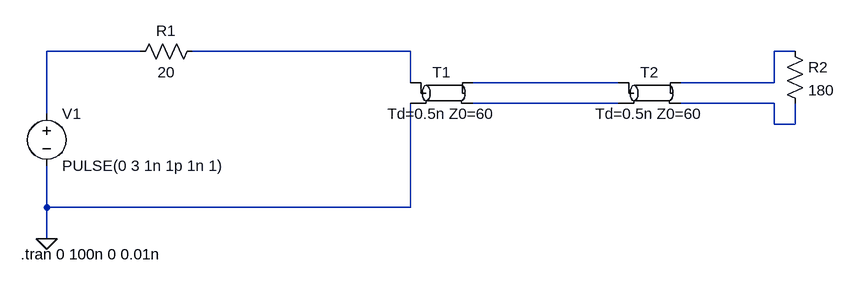
[diagram p0: schematic Q6.asc]
Q6.asc, the LTspice schematic file:
Version 4.1
SHEET 1 1412 680
WIRE 336 -16 192 -16
WIRE 752 -16 416 -16
WIRE 1344 -16 1312 -16
WIRE 752 32 752 -16
WIRE 1072 32 848 32
WIRE 1312 32 1312 -16
WIRE 1312 32 1168 32
WIRE 1072 64 848 64
WIRE 1312 64 1168 64
WIRE 192 80 192 -16
WIRE 1312 96 1312 64
WIRE 1344 96 1344 64
WIRE 1344 96 1312 96
WIRE 192 224 192 160
WIRE 752 224 752 64
WIRE 752 224 192 224
WIRE 192 272 192 224
FLAG 192 272 0
SYMBOL voltage 192 64 R0
WINDOW 123 0 0 Left 0
WINDOW 39 0 0 Left 0
SYMATTR InstName V1
SYMATTR Value PULSE(0 3 1n 1p 1n 1)
SYMBOL res 432 -32 R90
WINDOW 0 0 56 VBottom 2
WINDOW 3 32 56 VTop 2
SYMATTR InstName R1
SYMATTR Value 20
SYMBOL tline 800 48 R0
SYMATTR InstName T1
SYMATTR Value Td=0.5n Z0=60
SYMBOL res 1328 -32 R0
SYMATTR InstName R2
SYMATTR Value 180
SYMBOL tline 1120 48 R0
SYMATTR InstName T2
SYMATTR Value Td=0.5n Z0=60
TEXT 152 296 Left 2 !.tran 0 100n 0 0.01n

The netlist it stands for:
* Q6.asc
V1 N001 0 PULSE(0 3 1n 1p 1n 1)
R1 N002 N001 20
T1 N002 0 N004 N005 Td=0.5n Z0=60
R2 N003 N006 180
T2 N004 N005 N003 N006 Td=0.5n Z0=60
.tran 0 100n 0 0.01n
.backanno
.end